# EAGLE design differential-buffer-quadchannel (EAGLE 9.0.1)
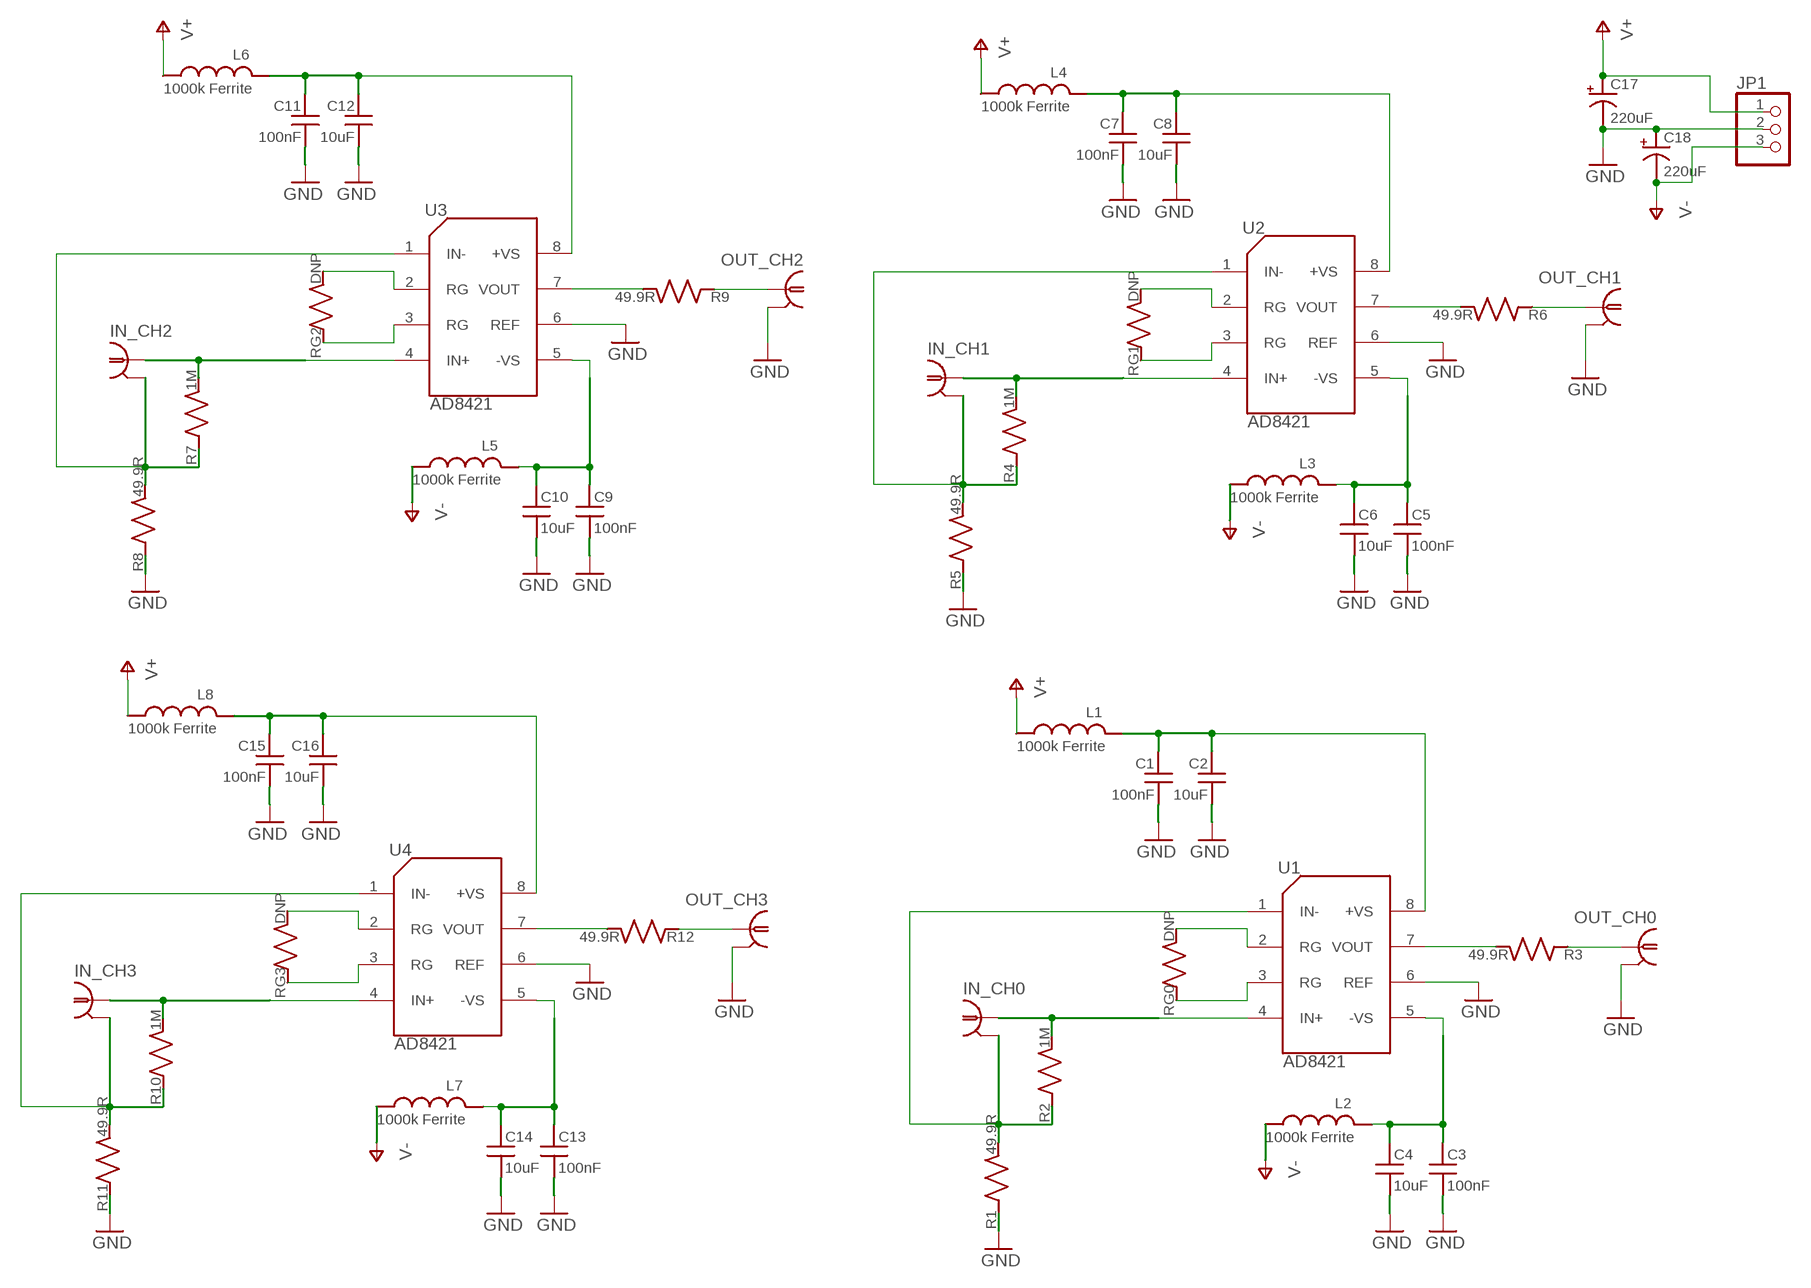
[diagram p0: schematic, sheet 1]

## Parts
C1  100nF  C_MLCC_SMDCMLCC_0603  [C_MLCC_0603]
C2  10uF  C_MLCC_SMDCMLCC_0805  [C_MLCC_0805]
C3  100nF  C_MLCC_SMDCMLCC_0603  [C_MLCC_0603]
C4  10uF  C_MLCC_SMDCMLCC_0805  [C_MLCC_0805]
C5  100nF  C_MLCC_SMDCMLCC_0603  [C_MLCC_0603]
C6  10uF  C_MLCC_SMDCMLCC_0805  [C_MLCC_0805]
C7  100nF  C_MLCC_SMDCMLCC_0603  [C_MLCC_0603]
C8  10uF  C_MLCC_SMDCMLCC_0805  [C_MLCC_0805]
C9  100nF  C_MLCC_SMDCMLCC_0603  [C_MLCC_0603]
C10  10uF  C_MLCC_SMDCMLCC_0805  [C_MLCC_0805]
C11  100nF  C_MLCC_SMDCMLCC_0603  [C_MLCC_0603]
C12  10uF  C_MLCC_SMDCMLCC_0805  [C_MLCC_0805]
C13  100nF  C_MLCC_SMDCMLCC_0603  [C_MLCC_0603]
C14  10uF  C_MLCC_SMDCMLCC_0805  [C_MLCC_0805]
C15  100nF  C_MLCC_SMDCMLCC_0603  [C_MLCC_0603]
C16  10uF  C_MLCC_SMDCMLCC_0805  [C_MLCC_0805]
C17  220uF  C_POL_SMDF  [PANASONIC_F]
C18  220uF  C_POL_SMDF  [PANASONIC_F]
IN_CH0  BNC-V  [BNC-V]
IN_CH1  BNC-V  [BNC-V]
IN_CH2  BNC-V  [BNC-V]
IN_CH3  BNC-V  [BNC-V]
JP1  PINHD-1X3  [1X03]
L1  1000k Ferrite  L_FERRITE_SMDLFERRITE_0603  [L_FERRITE_0603]
L2  1000k Ferrite  L_FERRITE_SMDLFERRITE_0603  [L_FERRITE_0603]
L3  1000k Ferrite  L_FERRITE_SMDLFERRITE_0603  [L_FERRITE_0603]
L4  1000k Ferrite  L_FERRITE_SMDLFERRITE_0603  [L_FERRITE_0603]
L5  1000k Ferrite  L_FERRITE_SMDLFERRITE_0603  [L_FERRITE_0603]
L6  1000k Ferrite  L_FERRITE_SMDLFERRITE_0603  [L_FERRITE_0603]
L7  1000k Ferrite  L_FERRITE_SMDLFERRITE_0603  [L_FERRITE_0603]
L8  1000k Ferrite  L_FERRITE_SMDLFERRITE_0603  [L_FERRITE_0603]
OUT_CH0  BNC-V  [BNC-V]
OUT_CH1  BNC-V  [BNC-V]
OUT_CH2  BNC-V  [BNC-V]
OUT_CH3  BNC-V  [BNC-V]
R1  49.9R  R_SMDR0603  [R_0603]
R2  1M  R_SMDR0603  [R_0603]
R3  49.9R  R_SMDR0603  [R_0603]
R4  1M  R_SMDR0603  [R_0603]
R5  49.9R  R_SMDR0603  [R_0603]
R6  49.9R  R_SMDR0603  [R_0603]
R7  1M  R_SMDR0603  [R_0603]
R8  49.9R  R_SMDR0603  [R_0603]
R9  49.9R  R_SMDR0603  [R_0603]
R10  1M  R_SMDR0603  [R_0603]
R11  49.9R  R_SMDR0603  [R_0603]
R12  49.9R  R_SMDR0603  [R_0603]
RG0  DNP  R_SMDR0402  [R_0402]
RG1  DNP  R_SMDR0402  [R_0402]
RG2  DNP  R_SMDR0402  [R_0402]
RG3  DNP  R_SMDR0402  [R_0402]
U1  AD8421  [SOIC-8]
U2  AD8421  [SOIC-8]
U3  AD8421  [SOIC-8]
U4  AD8421  [SOIC-8]

## Nets
GND: C1.P$2 C2.P$2 C3.P$2 C4.P$2 C5.P$2 C6.P$2 C7.P$2 C8.P$2 C9.P$2 C10.P$2 C11.P$2 C12.P$2 C13.P$2 C14.P$2 C15.P$2 C16.P$2 C17.- C18.+ JP1.2 OUT_CH0.2 OUT_CH1.2 OUT_CH2.2 OUT_CH3.2 R1.P$1 R5.P$1 R8.P$1 R11.P$1 U1.6(REF) U2.6(REF) U3.6(REF) U4.6(REF)
N$1: OUT_CH0.1 R3.P$1
N$2: R3.P$2 U1.7(VOUT)
N$3: C1.P$1 C2.P$1 L1.P$1 U1.8(+VS)
N$4: RG0.P$1 U1.3(RG)
N$5: RG0.P$2 U1.2(RG)
N$6: IN_CH1.1 R4.P$2 U2.4(IN+)
N$7: IN_CH1.2 R4.P$1 R5.P$2 U2.1(IN-)
N$8: OUT_CH1.1 R6.P$1
N$9: R6.P$2 U2.7(VOUT)
N$10: C5.P$1 C6.P$1 L3.P$1 U2.5(-VS)
N$11: C7.P$1 C8.P$1 L4.P$1 U2.8(+VS)
N$12: RG1.P$1 U2.3(RG)
N$13: RG1.P$2 U2.2(RG)
N$14: IN_CH2.1 R7.P$2 U3.4(IN+)
N$15: IN_CH2.2 R7.P$1 R8.P$2 U3.1(IN-)
N$16: OUT_CH2.1 R9.P$1
N$17: R9.P$2 U3.7(VOUT)
N$18: C9.P$1 C10.P$1 L5.P$1 U3.5(-VS)
N$19: C11.P$1 C12.P$1 L6.P$1 U3.8(+VS)
N$20: RG2.P$1 U3.3(RG)
N$21: RG2.P$2 U3.2(RG)
N$22: IN_CH3.1 R10.P$2 U4.4(IN+)
N$23: IN_CH3.2 R10.P$1 R11.P$2 U4.1(IN-)
N$24: OUT_CH3.1 R12.P$1
N$25: R12.P$2 U4.7(VOUT)
N$26: C13.P$1 C14.P$1 L7.P$1 U4.5(-VS)
N$27: C15.P$1 C16.P$1 L8.P$1 U4.8(+VS)
N$28: RG3.P$1 U4.3(RG)
N$29: RG3.P$2 U4.2(RG)
N$56: IN_CH0.1 R2.P$2 U1.4(IN+)
N$57: IN_CH0.2 R1.P$2 R2.P$1 U1.1(IN-)
N$63: C3.P$1 C4.P$1 L2.P$1 U1.5(-VS)
V+: C17.+ JP1.1 L1.P$2 L4.P$2 L6.P$2 L8.P$2
V-: C18.- JP1.3 L2.P$2 L3.P$2 L5.P$2 L7.P$2

## Library data of the parts
C1 C3 C5 C7 C9 C11 C13 C15 = Eurocard-HV-piezo-driver:C_MLCC_SMD; PARTNO: 1276-1936-1-ND
C2 C4 C6 C8 C10 C12 C14 C16 = Eurocard-HV-piezo-driver:C_MLCC_SMD; PARTNO: 445-14417-1-ND
C17 C18 = jqi_passives:C_POL_SMD; PARTNO: PCE3955CT-ND
IN_CH0 IN_CH1-IN_CH3 OUT_CH0 OUT_CH1-OUT_CH3 = connector-jqi:BNC: BNC Connector.
JP1 = pinhead:PINHD-1X3: PIN HEADER; PARTNO: WM4201-ND
L1-L8 = Eurocard-HV-piezo-driver:L_FERRITE_SMD; PARTNO: 445-1548-1-ND
R1 R3 R5 R6 R8 R9 R11 R12 = jqi_passives:R_SMD; PARTNO: P49.9HCT-ND
R2 R4 R7 R10 = Eurocard-HV-piezo-driver:R_SMD; PARTNO: P1.00MHCT-ND
RG0 RG1-RG3 = jqi_passives:R_SMD
U1-U4 = differential-buffer:AD8421; PARTNO: AD8421ARZ-R7CT-ND

## Board
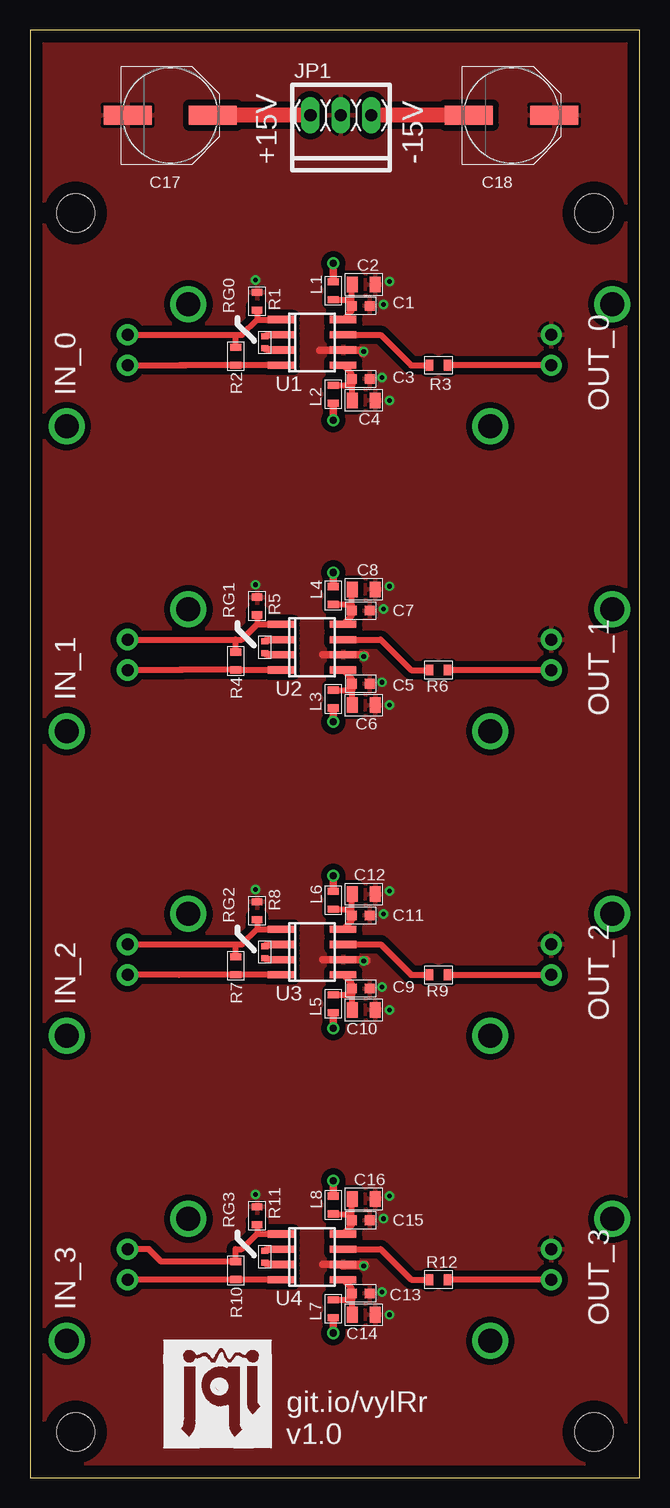
[diagram p1: board, top side]
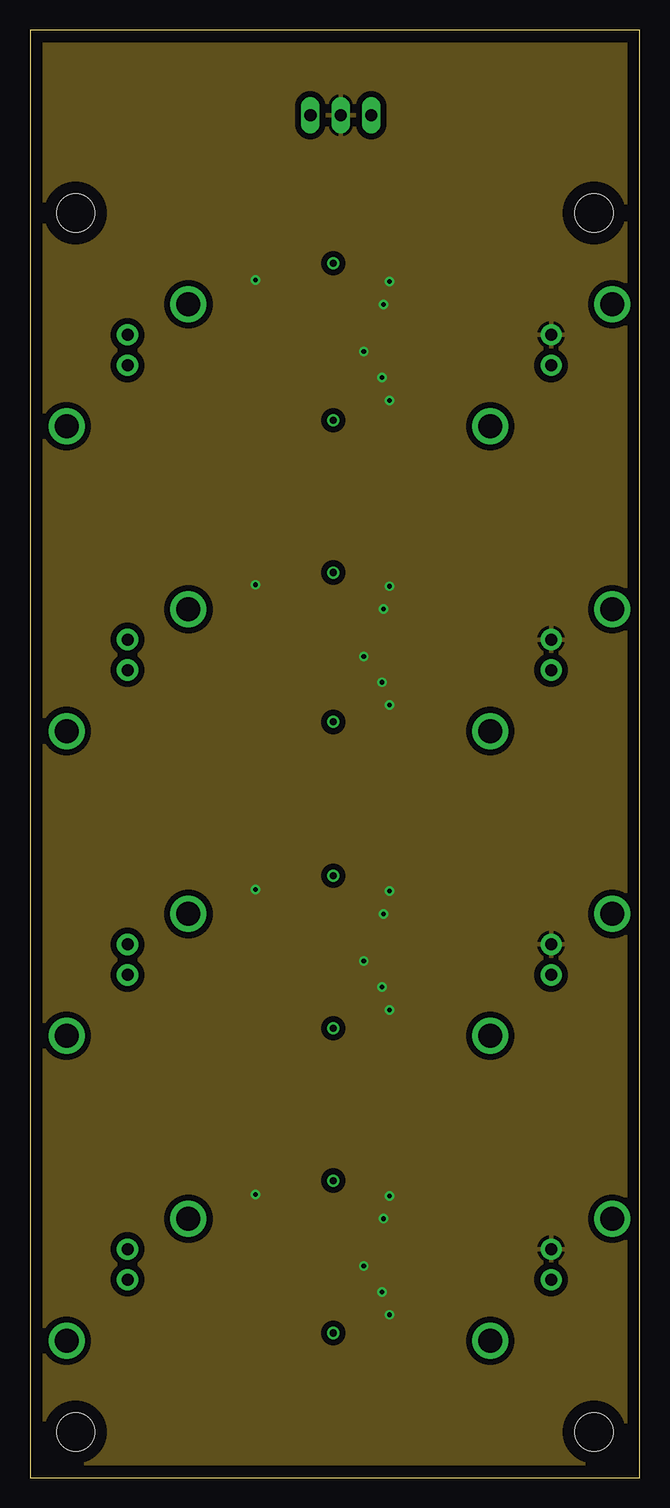
[diagram p2: board, inner layer Route2]
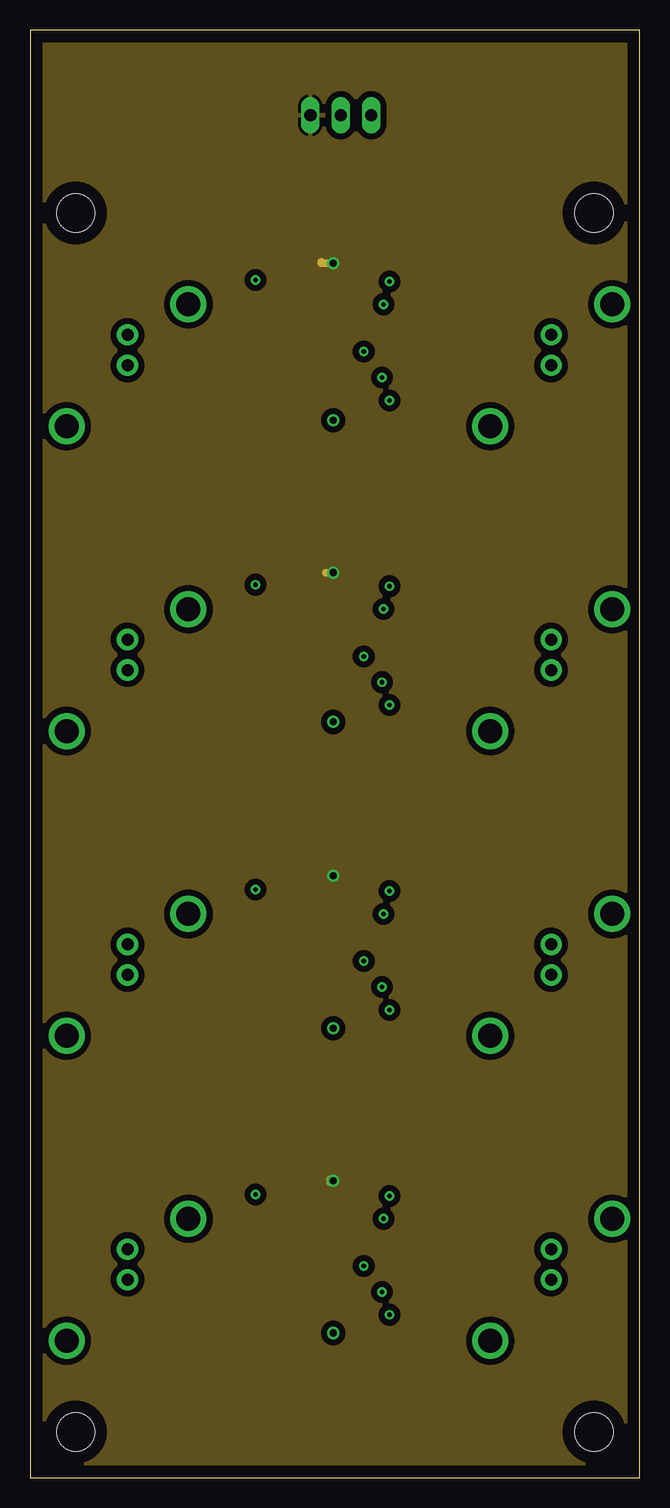
[diagram p3: board, inner layer Route15]
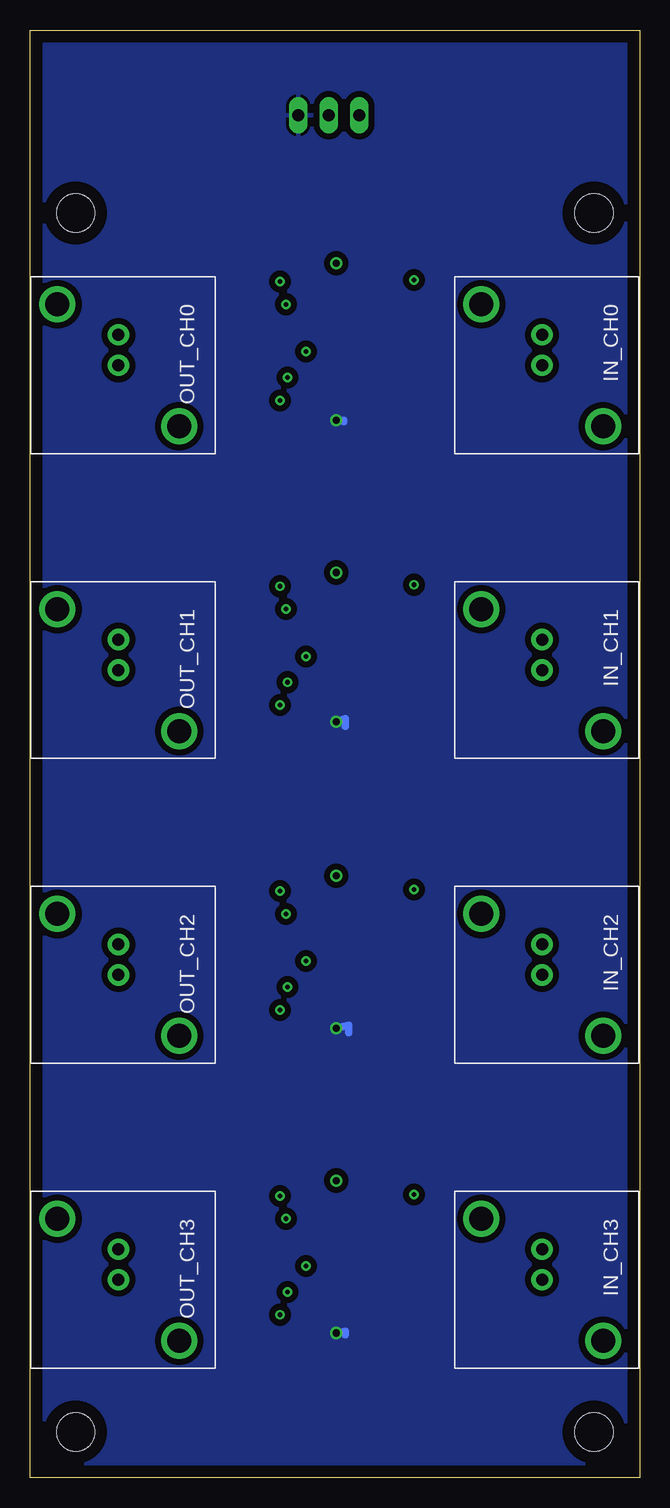
[diagram p4: board, bottom side, seen from below]

Size 50.8 x 120.65 mm. Coordinates in mm from the lower left corner, seen from the top.
Outline: 0,120.65 0,0 50.8,0 50.8,120.65 0,120.65
Copper layers (1*2+15*16): Top 0.035mm / dielectric 1.5mm / Route2 0.035mm / dielectric 0.15mm / Route15 0.035mm / dielectric 0.2mm / Bottom 0.035mm
Design rules "default *": minimum track width 10mil, minimum drill 24mil, track to track 8mil, track to pad 8mil, pad to pad 8mil, via to via 8mil, smd to smd 8mil, copper to edge 40mil, drill to drill 8mil, minimum pad ring 10mil, minimum via ring 8mil, stop-mask expansion 4mil, vias tented up to drill 0mil, thermal gap 10mil
Holes 3.17 mm at 46.99,105.41 3.81,105.41 3.81,3.81 46.99,3.81

### Footprints (pad centres in the part's own frame; a part is rotated, then mirrored left to right if it is on the bottom)
C_MLCC_0603 = smd 0.8 x 0.8: P$1 -0.75,0; P$2 0.75,0
C_MLCC_0805 = smd 0.9 x 1.3: P$1 -0.95,0; P$2 0.95,0
PANASONIC_F = smd 4 x 1.6: + 3.55,0; - -3.55,0
BNC-V = drill 1 pad 1.778: 1 0,0; 2 -2.54,0 | drill 2 pad 2.032: ANCHOR1 -5.08,-5.08; ANCHOR2 5.08,5.08
1X03 = drill 1.016 long: 1 -2.54,0; 2 0,0; 3 2.54,0
L_FERRITE_0603 = smd 0.6 x 0.9: P$1 -0.75,0; P$2 0.75,0
R_0603 = smd 0.6 x 0.9: P$1 -0.75,0; P$2 0.75,0
R_0402 = smd 0.5 x 0.6: P$1 -0.5,0; P$2 0.5,0
SOIC-8 = smd 0.6 x 2.2: 1 -1.905,-2.6; 2 -0.635,-2.6; 3 0.635,-2.6; 4 1.905,-2.6; 5 1.905,2.6; 6 0.635,2.6; 7 -0.635,2.6; 8 -1.905,2.6

### Placement (x,y rotation side)
C1  27.56,97.66 0 top
C2  27.81,99.44 0 top
C3  27.56,91.57 0 top
C4  27.81,89.79 0 top
C5  27.56,66.17 0 top
C6  27.81,64.39 0 top
C7  27.56,72.26 0 top
C8  27.81,74.04 0 top
C9  27.56,40.77 0 top
C10  27.81,38.99 0 top
C11  27.56,46.86 0 top
C12  27.81,48.64 0 top
C13  27.56,15.37 0 top
C14  27.81,13.59 0 top
C15  27.56,21.46 0 top
C16  27.81,23.24 0 top
C17  11.68,113.54 0 top
C18  40.13,113.54 0 top
IN_CH0  8.13,92.71 270 bottom
IN_CH1  8.13,67.31 270 bottom
IN_CH2  8.13,41.91 270 bottom
IN_CH3  8.13,16.51 270 bottom
JP1  25.91,113.54 0 top
L1  25.27,98.93 90 top
L2  25.27,90.3 270 top
L3  25.27,64.9 270 top
L4  25.27,73.53 90 top
L5  25.27,39.5 270 top
L6  25.27,48.13 90 top
L7  25.27,14.1 270 top
L8  25.27,22.73 90 top
OUT_CH0  43.43,92.71 270 bottom
OUT_CH1  43.43,67.31 270 bottom
OUT_CH2  43.43,41.91 270 bottom
OUT_CH3  43.43,16.51 270 bottom
R1  18.92,98.04 270 top
R2  17.14,93.47 270 top
R3  34.04,92.71 180 top
R4  17.14,68.07 270 top
R5  18.92,72.64 270 top
R6  34.04,67.31 180 top
R7  17.14,42.67 270 top
R8  18.92,47.24 270 top
R9  34.04,41.91 180 top
R10  17.14,17.27 270 top
R11  18.92,21.84 270 top
R12  34.04,16.51 180 top
RG0  19.56,94.62 90 top
RG1  19.56,69.22 90 top
RG2  19.56,43.82 90 top
RG3  19.56,18.42 90 top
U1  23.49,94.62 270 top
U2  23.49,69.22 270 top
U3  23.49,43.82 270 top
U4  23.49,18.42 270 top
U$1  [JQI_LOGO_NEGATIVE-SILKSCREEN]  11.18,2.54 0 top

### Tracks (layer width: path | path; a pad name or v marks a point on that pad's centre or on a via)
GND  (via drill 0.38)
  Top 0.635: U4.6 27.94,17.78 27.94,17.65 26.04,17.65 26.04,17.78 24.38,17.78 | 24.38,43.18 U3.6 28.07,43.18 28.07,43.05 | 24.38,68.58 U2.6 27.94,68.58 27.94,68.45 | 27.69,93.98 U1.6 24.13,93.98 | 27.69,93.98 27.81,93.98 27.81,93.73 27.69,93.73 27.69,93.98
  other vias: 29.97,99.7 29.46,97.79 29.34,91.69 29.97,89.79 27.81,93.85 18.8,99.82 29.97,74.3 29.46,72.39 29.34,66.29 29.97,64.39 27.81,68.45 18.8,74.42 29.97,48.9 29.46,46.99 29.34,40.89 29.97,38.99 27.81,43.05 18.8,49.02 29.97,23.5 29.46,21.59 29.34,15.49 29.97,13.59 27.81,17.65 18.8,23.62
  pour Top (isolate 0.508): 0,120.65 50.8,120.65 50.8,0 0,0
  pour Route2 (isolate 0.508): 0,120.65 50.8,120.65 50.8,0 0,0
N$1
  Top 0.508: OUT_CH0.1 R3.P$1
N$2
  Top 0.508: U1.7 29.21,95.25 31.75,92.71 R3.P$2
N$3
  Top 0.508: U1.8 26.81,97.23 C1.P$1 26.81,98.17 | 26.81,98.17 26.81,99.39 C2.P$1 | L1.P$1 26.8,98.18 26.81,98.17
N$4
  Top 0.508: U1.3 19.69,93.98 RG0.P$1
N$5
  Top 0.508: U1.2 19.69,95.25 RG0.P$2
N$6
  Top 0.508: 12.7,67.32 R4.P$2 U2.4 | 12.7,67.32 12.45,67.32 | 12.7,67.32 12.69,67.31 IN_CH1.1
N$7
  Top 0.508: 17.14,69.85 17.65,69.85 18.92,71.12 | 18.92,71.12 U2.1 | R4.P$1 17.14,69.85 | R5.P$2 18.92,71.12 | IN_CH1.2 17.14,69.85
N$8
  Top 0.508: OUT_CH1.1 R6.P$1
N$9
  Top 0.508: U2.7 29.21,69.85 31.75,67.31 R6.P$2
N$10
  Top 0.508: U2.5 26.81,66.6 C5.P$1 26.86,66.11 26.86,65.66 | C6.P$1 26.86,65.66 | L3.P$1 26.85,65.65 26.86,65.66
N$11
  Top 0.508: U2.8 26.81,71.83 C7.P$1 26.81,72.77 | 26.81,72.77 26.81,73.99 C8.P$1 | L4.P$1 26.8,72.78 26.81,72.77
N$12
  Top 0.508: U2.3 19.69,68.58 RG1.P$1
N$13
  Top 0.508: U2.2 19.69,69.85 RG1.P$2
N$14
  Top 0.508: U3.4 R7.P$2 12.45,41.92 12.43,41.91 IN_CH2.1
N$15
  Top 0.508: 17.14,44.45 17.27,44.45 17.65,44.45 18.92,45.72 | 18.92,45.72 U3.1 | R7.P$1 17.14,44.45 | R8.P$2 18.92,45.72 | IN_CH2.2 17.14,44.45
N$16
  Top 0.508: R9.P$1 OUT_CH2.1
N$17
  Top 0.508: U3.7 29.21,44.45 31.75,41.91 R9.P$2
N$18
  Top 0.508: U3.5 26.81,41.2 C9.P$1 26.86,40.71 26.86,40.26 | C10.P$1 26.86,40.26 | L5.P$1 26.85,40.25 26.86,40.26
N$19
  Top 0.508: U3.8 26.81,46.43 C11.P$1 26.81,47.37 | 26.81,47.37 26.81,48.59 C12.P$1 | L6.P$1 26.8,47.38 26.81,47.37
N$20
  Top 0.508: U3.3 19.69,43.18 RG2.P$1
N$21
  Top 0.508: U3.2 19.69,44.45 RG2.P$2
N$22
  Top 0.508: 12.7,16.52 R10.P$2 U4.4 | 12.7,16.52 12.45,16.52 | 12.7,16.52 12.69,16.51 IN_CH3.1
N$23
  Top 0.508: 18.92,20.32 17.65,19.05 17.14,19.05 R10.P$1 10.93,18.02 9.91,19.05 IN_CH3.2 | 18.92,20.32 U4.1 | R11.P$2 18.92,20.32
N$24
  Top 0.508: OUT_CH3.1 R12.P$1
N$25
  Top 0.508: U4.7 29.21,19.05 31.75,16.51 R12.P$2
N$26
  Top 0.508: U4.5 26.81,15.8 C13.P$1 26.86,15.31 26.86,14.86 | C14.P$1 26.86,14.86 | L7.P$1 26.85,14.85 26.86,14.86
N$27
  Top 0.508: U4.8 26.81,21.03 C15.P$1 26.81,21.97 | 26.81,21.97 26.81,23.19 C16.P$1 | L8.P$1 26.8,21.98 26.81,21.97
N$28
  Top 0.508: U4.3 19.69,17.78 RG3.P$1
N$29
  Top 0.508: U4.2 19.69,19.05 RG3.P$2
N$56
  Top 0.508: 12.95,92.72 R2.P$2 U1.4 | 12.95,92.72 12.45,92.72 | IN_CH0.1 12.94,92.71 12.95,92.72
N$57
  Top 0.508: 17.14,95.25 17.65,95.25 18.92,96.52 | 18.92,96.52 U1.1 | R2.P$1 17.14,95.25 | R1.P$2 18.92,96.52 | IN_CH0.2 17.14,95.25
N$63
  Top 0.508: U1.5 26.81,92 C3.P$1 26.86,91.51 26.86,91.06 | C4.P$1 26.86,91.06 | L2.P$1 26.85,91.05 26.86,91.06
V+  (via drill 0.6)
  Top 0.635: L1.P$2 v25.27,101.22 | L4.P$2 v25.27,75.44 | L6.P$2 v25.27,50.17 | L8.P$2 v25.27,24.77
  Top 1.27: JP1.1 C17.+
  Route15 0.635: v25.27,101.22 24.26,101.22 24.26,101.35 | v25.27,75.44 24.64,75.44 | v25.27,50.17 25.15,50.17 25.15,50.29 | v25.27,24.77 25.02,24.64 25.02,24.89
  pour Route15 (isolate 0.508): 0,120.65 50.8,120.65 50.8,0 0,0
V-  (via drill 0.6)
  Top 0.635: L2.P$2 v25.27,88.14 | L3.P$2 v25.27,62.99 | L5.P$2 v25.27,37.47 | L7.P$2 v25.27,12.06
  Top 1.27: C18.- JP1.3
  Bottom 0.635: v25.27,88.14 24.64,88.14 24.64,88.01 | v25.27,62.99 24.51,63.25 24.51,62.61 | v25.27,37.47 24.26,37.72 24.26,37.08 | v25.27,12.06 24.51,12.19 24.51,11.94
  pour Bottom (isolate 0.508): 0,120.65 50.8,120.65 50.8,0 0,0

### Text on the board
tPlace: +15V | -15V | IN_0 | OUT_0 | IN_1 | OUT_1 | IN_2 | OUT_2 | IN_3 | OUT_3 | git.io/vylRr / v1.0